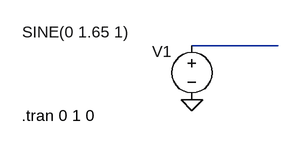
[diagram p0: schematic Integrator_circuit_test.asc]
Integrator_circuit_test.asc, the LTspice schematic file:
Version 4
SHEET 1 936 680
WIRE 208 128 80 128
FLAG 80 208 0
SYMBOL voltage 80 112 R0
WINDOW 0 -59 25 Left 2
WINDOW 3 -251 -4 Left 2
WINDOW 123 0 0 Left 0
WINDOW 39 0 0 Left 0
SYMATTR InstName V1
SYMATTR Value SINE(0 1.65 1)
TEXT -172 232 Left 2 !.tran 0 1 0

The netlist it stands for:
* Integrator_circuit_test.asc
V1 N001 0 SINE(0 1.65 1)
.tran 0 1 0
.backanno
.end